# EAGLE board Slutsteg (EAGLE 9.6.2)
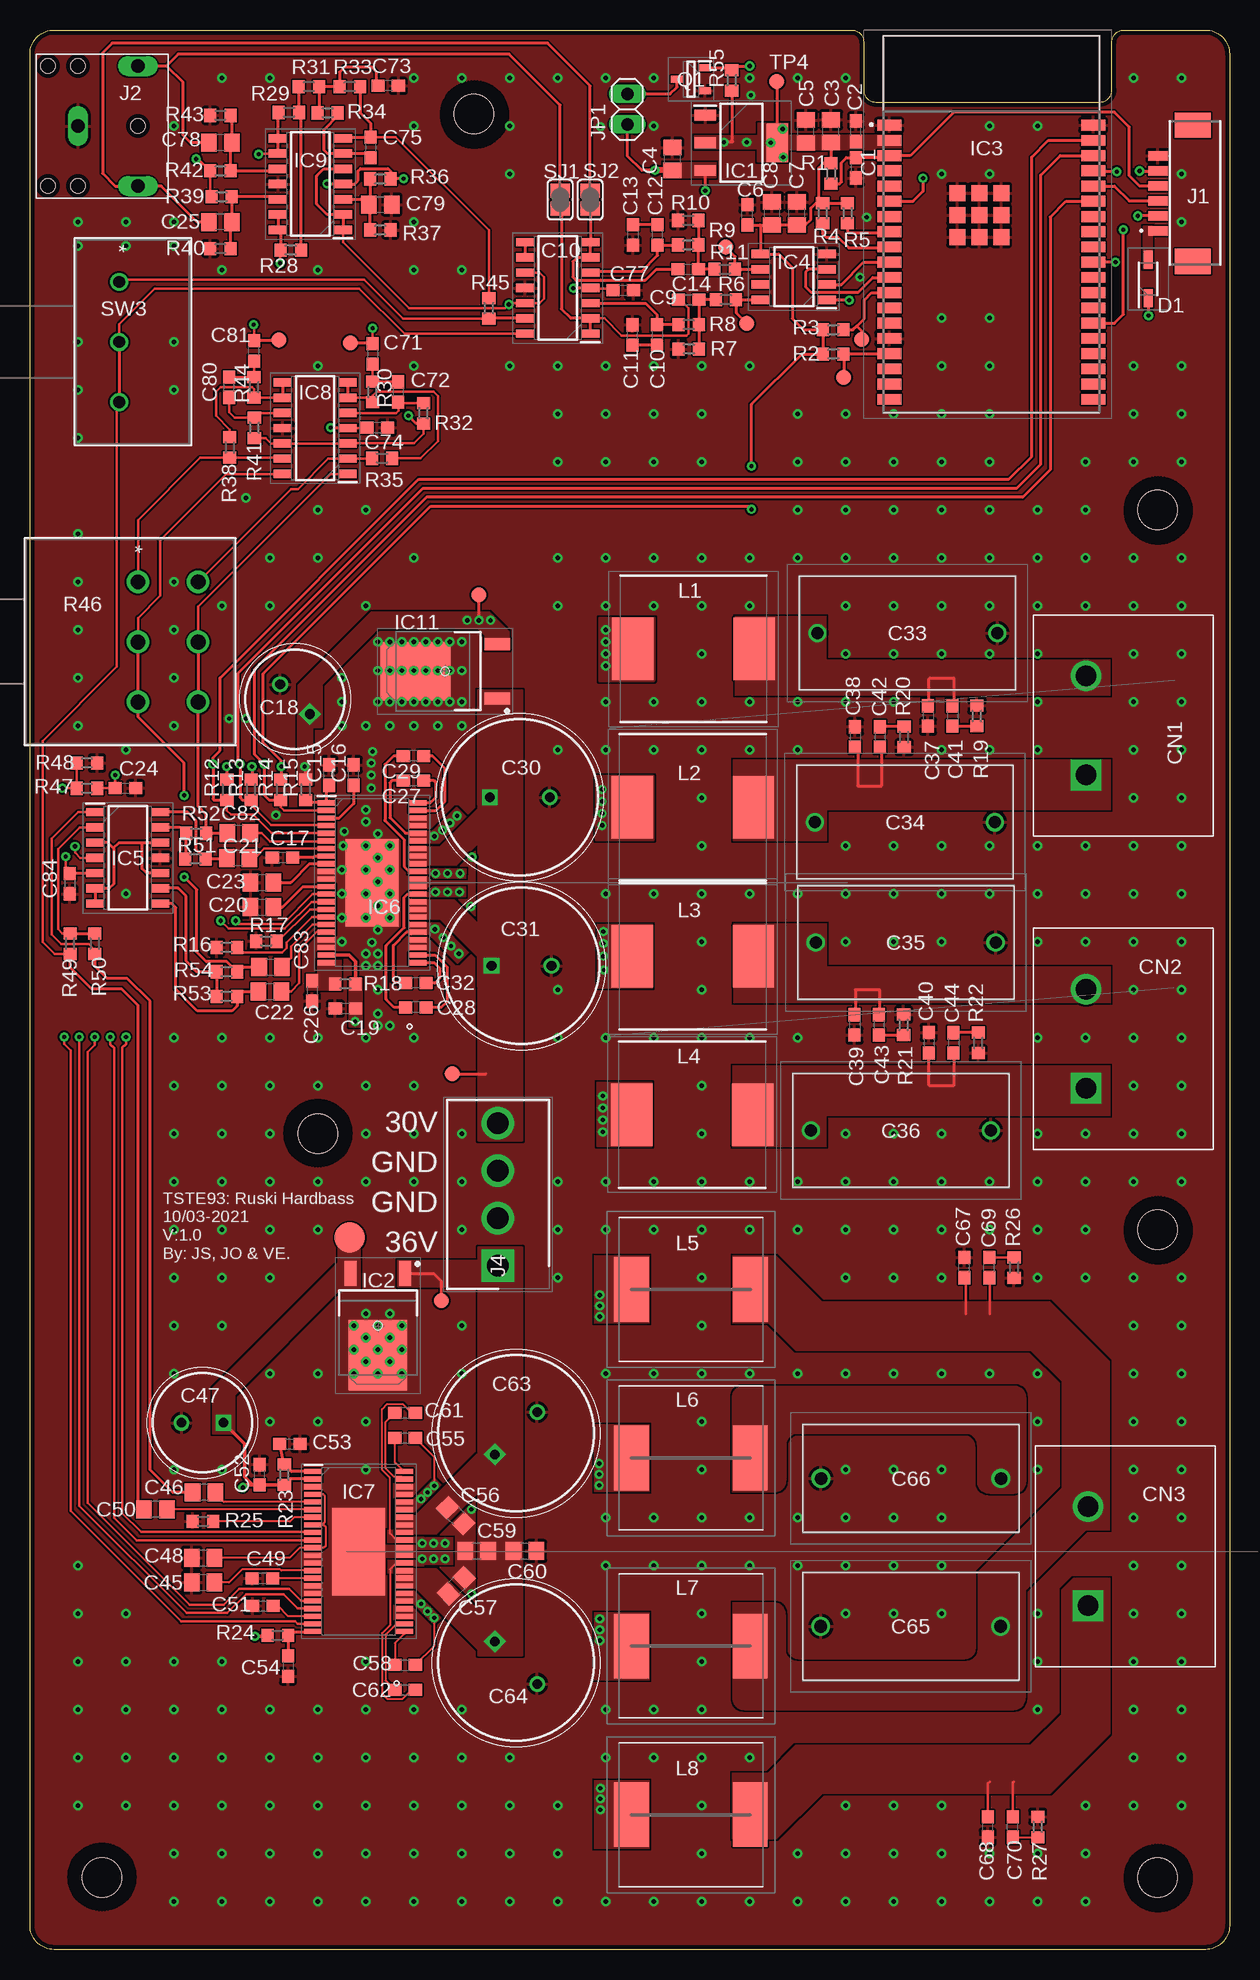
[diagram p6: board, top side]
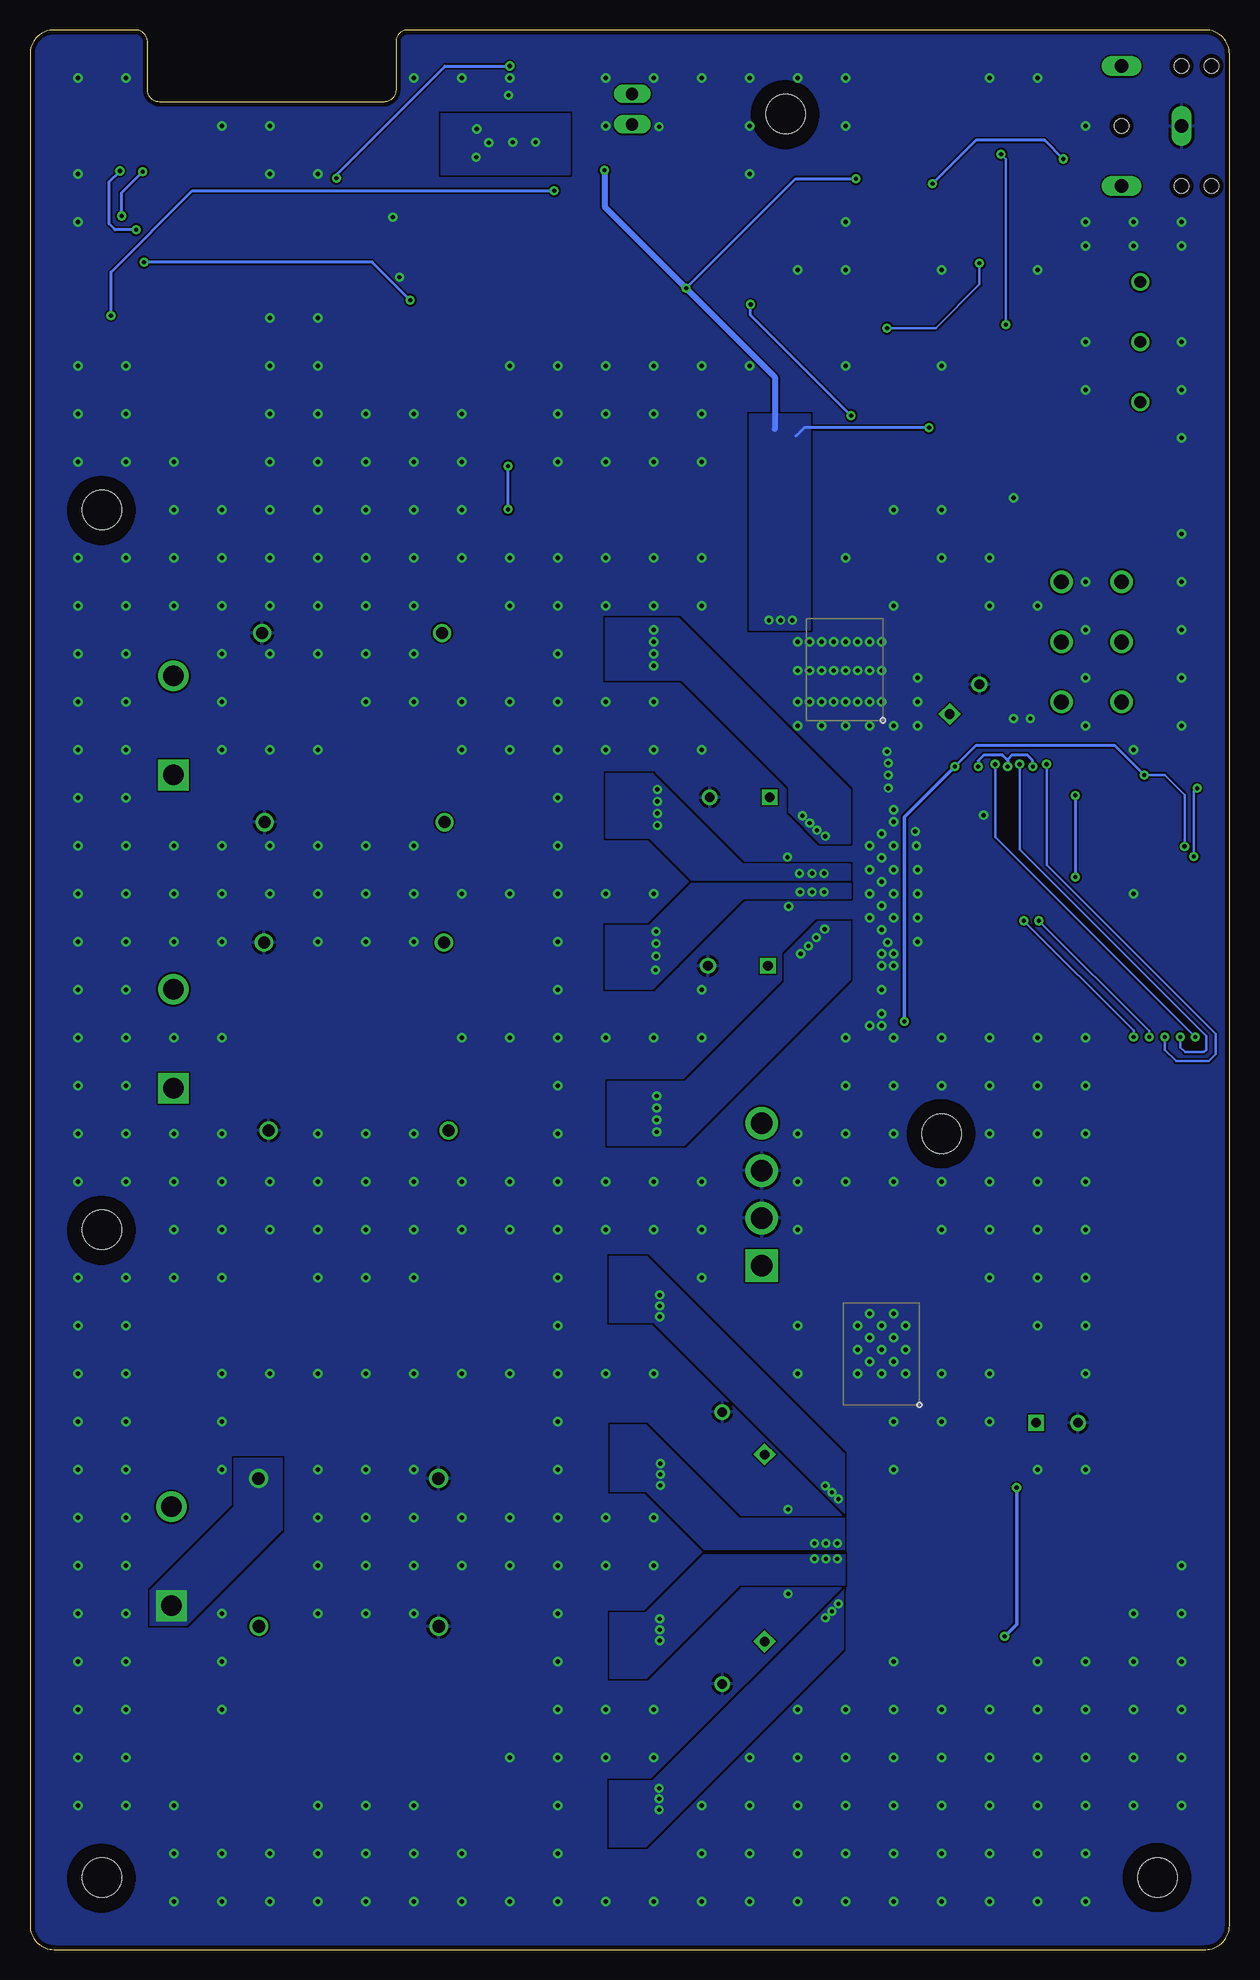
[diagram p7: board, bottom side, seen from below]

Size 100 x 160 mm. Coordinates in mm from the lower left corner, seen from the top.
Outline: 100,158 100,2 arc-90 98,0 2,0 arc-90 0,2 0,158 arc-90 2,160 68.5,160 arc-90 69.5,159 69.5,155 arc90 70.5,154 89.2,154 arc90 90.2,155 90.2,159 arc-90 91.2,160 98,160 arc-90 100,158
Copper layers (1*16): Top 0.035mm / dielectric 1.5mm / Bottom 0.035mm
Design rules "default *": minimum track width 6mil, minimum drill 0.35mm, track to track 6mil, track to pad 6mil, pad to pad 6mil, via to via 6mil, smd to smd 6mil, copper to edge 15mil, drill to drill 6mil, minimum pad ring 10mil, minimum via ring 8mil, stop-mask expansion 4mil, vias tented up to drill 20mil, thermal gap 10mil
Holes 3.3 mm at 6,6 94,6 94,60 94,120 37,153 24,68

## Footprints (pad centres in the part's own frame; a part is rotated, then mirrored left to right if it is on the bottom)
C0603 = smd 1.1 x 1: 1 -0.85,0; 2 0.85,0
C0805 = smd 1.3 x 1.5: 1 -0.95,0; 2 0.95,0
CAPPRD350W60D825H1300 = drill 0.8 pad 1.2 square: 1 0,0 | drill 0.8 pad 1.2: 2 3.5,0
CAPPRD500W60D1300H2650 = drill 0.8 pad 1.2 square: 1 0,0 | drill 0.8 pad 1.2: 2 5,0
PHE426HB7100JR06 = drill 1 pad 1.5: 1 0,0; 2 15,0
B32652A3684J = drill 1.05 pad 1.575: 1 0,0; 2 15,0
OSTYK33108030-2 = drill 1.7 square: 1 0,0 | drill 1.7: 2 8.25,0
SOD3816X145N = smd 1.5 x 0.75: 1 -1.6,0; 2 1.6,0
SOT230P700X180-4N = smd 1.8 x 0.9: 1 -3,2.3; 2 -3,0; 3 -3,-2.3 | smd 1.8 x 3.2: 4 3,0
TO228P972X240-3N = smd 2.1 x 1: 1 -4.35,2.28; 3 -4.35,-2.28 | smd 5.85 x 4.9: 4 2.45,0
ESP32WROVERE8MB = smd 2 x 0.9: 1 -8.5,8.26; 2 -8.5,6.99; 3 -8.5,5.72; 4 -8.5,4.45; 5 -8.5,3.18; 6 -8.5,1.91; 7 -8.5,0.64; 8 -8.5,-0.63; 9 -8.5,-1.9; 10 -8.5,-3.17; 11 -8.5,-4.44; 12 -8.5,-5.71; 13 -8.5,-6.98; 14 -8.5,-8.25; 15 -8.5,-9.52; 16 -8.5,-10.79; 17 -8.5,-12.06; 18 -8.5,-13.33; 19 -8.5,-14.6; 20 8.5,-14.6; 21 8.5,-13.33; 22 8.5,-12.06; 23 8.5,-10.79; 24 8.5,-9.52; 25 8.5,-8.25; 26 8.5,-6.98; 27 8.5,-5.71; 28 8.5,-4.44; 29 8.5,-3.17; 30 8.5,-1.9; 31 8.5,-0.63; 32 8.5,0.64; 33 8.5,1.91; 34 8.5,3.18; 35 8.5,4.45; 36 8.5,5.72; 37 8.5,6.99; 38 8.5,8.26 | smd 1.33 x 1.33: 39 -1,0.76; A39 -2.835,2.595; B39 -1,2.595; C39 0.835,2.595; D39 -2.835,0.76; E39 0.835,0.76; F39 -2.835,-1.075; G39 -1,-1.075; H39 0.835,-1.075
SOIC127P600X196-8N = smd 1.55 x 0.7: 1 -2.75,1.905; 2 -2.75,0.635; 3 -2.75,-0.635; 4 -2.75,-1.905; 5 2.75,-1.905; 6 2.75,-0.635; 7 2.75,0.635; 8 2.75,1.905
SOIC127P600X175-14N = smd 1.525 x 0.7: 1 -2.712,3.81; 2 -2.712,2.54; 3 -2.712,1.27; 4 -2.712,0; 5 -2.712,-1.27; 6 -2.712,-2.54; 7 -2.712,-3.81; 8 2.712,-3.81; 9 2.712,-2.54; 10 2.712,-1.27; 11 2.712,0; 12 2.712,1.27; 13 2.712,2.54; 14 2.712,3.81
SOP64P810X120-45N = smd 1.475 x 0.435: 1 -3.788,6.668; 2 -3.788,6.032; 3 -3.788,5.398; 4 -3.788,4.762; 5 -3.788,4.128; 6 -3.788,3.492; 7 -3.788,2.858; 8 -3.788,2.222; 9 -3.788,1.588; 10 -3.788,0.952; 11 -3.788,0.318; 12 -3.788,-0.318; 13 -3.788,-0.952; 14 -3.788,-1.588; 15 -3.788,-2.222; 16 -3.788,-2.858; 17 -3.788,-3.492; 18 -3.788,-4.128; 19 -3.788,-4.762; 20 -3.788,-5.398; 21 -3.788,-6.032; 22 -3.788,-6.668; 23 3.788,-6.668; 24 3.788,-6.032; 25 3.788,-5.398; 26 3.788,-4.762; 27 3.788,-4.128; 28 3.788,-3.492; 29 3.788,-2.858; 30 3.788,-2.222; 31 3.788,-1.588; 32 3.788,-0.952; 33 3.788,-0.318; 34 3.788,0.318; 35 3.788,0.952; 36 3.788,1.588; 37 3.788,2.222; 38 3.788,2.858; 39 3.788,3.492; 40 3.788,4.128; 41 3.788,4.762; 42 3.788,5.398; 43 3.788,6.032; 44 3.788,6.668 | smd 4.43 x 7.3: 45 0,0
SOP64P810X120-45N@1 = smd 1.475 x 0.435: 1 -3.788,6.668; 2 -3.788,6.032; 3 -3.788,5.398; 4 -3.788,4.762; 5 -3.788,4.128; 6 -3.788,3.492; 7 -3.788,2.858; 8 -3.788,2.222; 9 -3.788,1.588; 10 -3.788,0.952; 11 -3.788,0.318; 12 -3.788,-0.318; 13 -3.788,-0.952; 14 -3.788,-1.588; 15 -3.788,-2.222; 16 -3.788,-2.858; 17 -3.788,-3.492; 18 -3.788,-4.128; 19 -3.788,-4.762; 20 -3.788,-5.398; 21 -3.788,-6.032; 22 -3.788,-6.668; 23 3.788,-6.668; 24 3.788,-6.032; 25 3.788,-5.398; 26 3.788,-4.762; 27 3.788,-4.128; 28 3.788,-3.492; 29 3.788,-2.858; 30 3.788,-2.222; 31 3.788,-1.588; 32 3.788,-0.952; 33 3.788,-0.318; 34 3.788,0.318; 35 3.788,0.952; 36 3.788,1.588; 37 3.788,2.222; 38 3.788,2.858; 39 3.788,3.492; 40 3.788,4.128; 41 3.788,4.762; 42 3.788,5.398; 43 3.788,6.032; 44 3.788,6.668 | smd 4.43 x 7.3: 45 0,0
0532610671 = smd 0.8 x 1.6: 1 -3.125,1.004; 2 -1.875,1.004; 3 -0.625,1.004; 4 0.625,1.004; 5 1.875,1.004; 6 3.125,1.004 | smd 2.1 x 3: 7 -5.675,-1.896; 8 5.675,-1.896
JW-PJ-307-4H = drill 1.1 long: 1 -2,0; 2 3,5; 5 3,-5 | hole 1.2: -4.5,5; -2,5; 3,0; -4.5,-5; -2,-5
SHDR4W114P0X396_1X4_1578X850X9 = drill 1.8 pad 2.7 square: 1 0,0 | drill 1.8 pad 2.7: 2 3.96,0; 3 7.92,0; 4 11.88,0
1X02 = drill 1.016 long: 1 -1.27,0; 2 1.27,0
INDPM122122X600N = smd 3.45 x 5.2: 1 -5.05,0; 2 5.05,0
WE-PD_1260/1245/1280/121054 = smd 2.9 x 5.4: 1 -4.95,0; 2 4.95,0
BSS64AHZGT116 = smd 1 x 0.6: 1 -1.15,-0.95; 2 -1.15,0.95; 3 1.15,0
R0603 = smd 1 x 1.1: 1 -0.85,0; 2 0.85,0
PDB18-2 = drill 1.245 pad 1.753: 1 0,0; 2 5.004,0; 3 10.008,0; 4 0,5.004; 5 5.004,5.004; 6 10.008,5.004
SJ = smd 1.168 x 1.6: 1 -0.762,0; 2 0.762,0
SW_420F-103A2_BRN = drill 0.991 pad 1.499: 1 0,0; 2 5.004,0; 3 10.008,0
B2,54 = smd 2.54 x 2.54: TP 0,0
B1,27 = smd 1.27 x 1.27: TP 0,0

## Placement (x,y rotation side)
C1  100nF/50V  [C0603]  68.87,148.51 270 top
C2  100nF/50V  [C0603]  68.86,151.56 90 top
C3  10uF/16V  [C0805]  66.78,151.56 90 top
C4  10uF/16V  [C0805]  53.55,149.25 90 top
C5  10uF/16V  [C0805]  64.7,151.55 90 top
C6  100nF/50V  [C0603]  59.8,144.6 90 top
C7  10uF/16V  [C0805]  63.93,144.71 90 top
C8  10uF/16V  [C0805]  61.87,144.71 90 top
C9  1nF/50V  [C0603]  54.92,137.52 0 top
C10  1nF/50V  [C0603]  52.29,134.58 270 top
C11  1nF/50V  [C0603]  50.24,134.57 90 top
C12  1nF/50V  [C0603]  52.32,142.93 90 top
C13  1nF/50V  [C0603]  50.25,142.93 270 top
C14  1nF/50V  [C0603]  54.88,140.06 0 top
C15  100nF/50V  [C0603]  24.95,97.9 90 top
C16  100nF/50V  [C0603]  26.98,97.9 90 top
C17  10nF/50V  [C0603]  21.05,91.01 180 top
C18  16PK470MEFC8X11.5  [CAPPRD350W60D825H1300]  23.33,102.98 135 top
C19  100nF/50V  [C0603]  26.3,78.42 180 top
C20  1uF/50V  [C0805]  19.34,86.9 0 top
C21  10uF/16V  [C0805]  17.35,91 0 top
C22  10uF/16V  [C0805]  20,79.85 0 top
C23  1uF/50V  [C0805]  19.34,88.95 0 top
C24  100nF/50V  [C0603]  7.95,96.8 0 top
C25  1uF/50V  [C0805]  15.88,144 180 top
C26  100nF/50V  [C0603]  23.51,79.9 270 top
C27  33nF/50V  [C0603]  31.97,97.42 180 top
C28  33nF/50V  [C0603]  32.17,78.54 180 top
C29  33nF/50V  [C0603]  31.97,99.5 180 top
C30  ECA-1HM102B  [CAPPRD500W60D1300H2650]  38.33,96.04 0 top
C31  ECA-1HM102B  [CAPPRD500W60D1300H2650]  38.48,81.99 0 top
C32  33nF/50V  [C0603]  32.17,80.56 180 top
C33  PHE426HB7100JR06  [PHE426HB7100JR06]  80.65,109.74 180 top
C34  PHE426HB7100JR06  [PHE426HB7100JR06]  65.45,93.96 0 top
C35  PHE426HB7100JR06  [PHE426HB7100JR06]  80.5,83.94 180 top
C36  PHE426HB7100JR06  [PHE426HB7100JR06]  65.1,68.26 0 top
C37  1nF/50V  [C0603]  74.87,102.82 270 top
C38  1nF/50V  [C0603]  68.79,101.07 270 top
C39  1nF/50V  [C0603]  68.74,77.07 270 top
C40  1nF/50V  [C0603]  74.92,75.58 270 top
C41  10nF/50V  [C0603]  76.91,102.82 270 top
C42  10nF/50V  [C0603]  70.85,101.07 270 top
C43  10nF/50V  [C0603]  70.77,77.07 270 top
C44  10nF/50V  [C0603]  77,75.57 270 top
C45  1uF/50V  [C0805]  14.44,30.6 0 top
C46  10uF/16V  [C0805]  14.51,38.1 180 top
C47  ECA-1HM471B  [CAPPRD350W60D825H1300]  16.13,43.9 180 top
C48  1uF/50V  [C0805]  14.44,32.65 0 top
C49  10nF/50V  [C0603]  19.37,30.95 0 top
C50  10uF/16V  [C0805]  10.46,36.7 180 top
C51  100nF/50V  [C0603]  19.42,28.63 0 top
C52  100nF/50V  [C0603]  19.16,39.58 90 top
C53  100nF/50V  [C0603]  21.67,42.15 0 top
C54  100nF/50V  [C0603]  21.52,23.63 270 top
C55  33nF/50V  [C0603]  31.27,42.63 0 top
C56  1uF/50V  [C0805]  35.49,36.17 315 top
C57  1uF/50V  [C0805]  35.54,30.32 225 top
C58  33nF/50V  [C0603]  31.27,23.71 0 top
C59  1uF/50V  [C0805]  37.24,33.23 0 top
C60  1uF/50V  [C0805]  41.26,33.23 0 top
C61  33nF/50V  [C0603]  31.27,44.75 0 top
C62  33nF/50V  [C0603]  31.27,21.64 0 top
C63  ECA-1HM102B  [CAPPRD500W60D1300H2650]  38.76,41.26 45 top
C64  ECA-1HM102B  [CAPPRD500W60D1300H2650]  38.76,25.67 315 top
C65  B32652A3684J  [B32652A3684J]  65.92,26.94 0 top
C66  B32652A3684J  [B32652A3684J]  80.95,39.26 180 top
C67  1nF/50V  [C0603]  77.88,56.84 90 top
C68  1nF/50V  [C0603]  79.85,10.22 90 top
C69  10nF/50V  [C0603]  79.97,56.84 90 top
C70  10nF/50V  [C0603]  81.93,10.22 90 top
C71  100nF/50V  [C0603]  28.56,133 270 top
C72  100nF/50V  [C0603]  30.68,129.82 270 top
C73  150nF/50V  [C0603]  29.86,155.35 180 top
C74  100nF/50V  [C0603]  28.95,126.86 0 top
C75  33nF/50V  [C0603]  28.4,150.21 270 top
C77  100nF/50V  [C0603]  49.46,138.3 0 top
C78  1uF/50V  [C0805]  15.88,150.6 180 top
C79  1uF/50V  [C0805]  29.2,145.46 0 top
C80  100nF/50V  [C0603]  16.62,130.22 90 top
C81  100nF/50V  [C0603]  18.67,133.25 90 top
C82  10uF/16V  [C0805]  17.4,93.05 0 top
C83  10uF/16V  [C0805]  20.05,81.9 0 top
C84  100nF/50V  [C0603]  3.3,88.85 270 top
CN1  OSTYK33102030-2  [OSTYK33108030-2]  88.05,97.9 90 top
CN2  OSTYK33102030-2  [OSTYK33108030-2]  88.05,71.8 90 top
CN3  OSTYK33102030-2  [OSTYK33108030-2]  88.2,28.65 90 top
D1  STPS0520Z  [SOD3816X145N]  93.22,139.25 90 top
IC1  SPX1117M3-L-3-3_TR  [SOT230P700X180-4N]  59.3,150.6 0 top
IC2  L78M12ABDT-TR  [TO228P972X240-3N]  29,52 270 top
IC3  ESP32-WROVER-IE-4MB  [ESP32WROVERE8MB]  80.14,143.81 0 top
IC4  TM8211  [SOIC127P600X196-8N]  63.67,139.42 180 top
IC5  LM324D  [SOIC127P600X175-14N]  8.15,91 0 top
IC6  TPA3244DDWR  [SOP64P810X120-45N]  28.52,88.92 0 top
IC7  TPA3251D2DDVR  [SOP64P810X120-45N@1]  27.4,33.18 0 top
IC8  LM324D  [SOIC127P600X175-14N]  23.77,126.81 180 top
IC9  LM324D  [SOIC127P600X175-14N]  23.38,147.16 180 top
IC10  LM324D  [SOIC127P600X175-14N]  44,138.5 180 top
IC11  L78M12ABDT-TR  [TO228P972X240-3N]  34.6,106.55 180 top
J1  0532610671  [0532610671]  95.04,146.38 90 top
J2  JW-PJ-307-4H  [JW-PJ-307-4H]  6,152 0 top
J4  B4P-VH_LF__SN_  [SHDR4W114P0X396_1X4_1578X850X9]  39,57 90 top
JP1  [1X02]  49.8,153.4 90 top
L1  48100SC  [INDPM122122X600N]  55.31,108.41 0 top
L2  48100SC  [INDPM122122X600N]  55.26,95.21 0 top
L3  48100SC  [INDPM122122X600N]  55.26,82.78 0 top
L4  48100SC  [INDPM122122X600N]  55.21,69.6 0 top
L5  74477010  [WE-PD_1260/1245/1280/121054]  55.1,55.02 0 top
L6  74477010  [WE-PD_1260/1245/1280/121054]  55.09,40.97 0 top
L7  74477010  [WE-PD_1260/1245/1280/121054]  55.09,25.3 0 top
L8  74477010  [WE-PD_1260/1245/1280/121054]  55.09,11.25 0 top
Q1  RK7002BMT116  [BSS64AHZGT116]  55.1,155.9 180 top
R1  10K/5%/0.1W  [R0603]  66.78,148.03 270 top
R2  10K/5%/0.1W  [R0603]  66.97,132.99 0 top
R3  10K/5%/0.1W  [R0603]  66.97,135.01 0 top
R4  10K/5%/0.1W  [R0603]  66.08,144.73 270 top
R5  10K/5%/0.1W  [R0603]  68.15,144.73 270 top
R6  10K/5%/0.1W  [R0603]  58.02,137.53 0 top
R7  10K/5%/0.1W  [R0603]  54.93,133.4 180 top
R8  10K/5%/0.1W  [R0603]  54.92,135.45 0 top
R9  10K/5%/0.1W  [R0603]  54.88,142.08 180 top
R10  10K/5%/0.1W  [R0603]  54.88,144.13 180 top
R11  10K/5%/0.1W  [R0603]  57.93,140.06 180 top
R12  20K/5%/0.1W  [R0603]  16.41,96.67 90 top
R13  20K/5%/0.1W  [R0603]  18.43,96.67 90 top
R14  20K/5%/0.1W  [R0603]  20.9,96.67 90 top
R15  3.3R/5%/0.1W  [R0603]  22.98,96.67 90 top
R16  20K/5%/0.1W  [R0603]  16.4,83.53 0 top
R17  20K/5%/0.1W  [R0603]  19.7,84.05 0 top
R18  3.3R/5%/0.1W  [R0603]  26.3,80.49 0 top
R19  3.3R/5%/0.1W  [R0603]  78.93,102.82 270 top
R20  3.3R/5%/0.1W  [R0603]  72.87,101.07 270 top
R21  3.3R/5%/0.1W  [R0603]  72.83,77.07 270 top
R22  3.3R/5%/0.1W  [R0603]  79.05,75.57 270 top
R23  3.3R/5%/0.1W  [R0603]  21.2,39.58 90 top
R24  3.3R/5%/0.1W  [R0603]  20.65,26.18 0 top
R25  20K/5%/0.1W  [R0603]  14.43,35.68 0 top
R26  3.3R/5%/0.1W  [R0603]  82.04,56.84 90 top
R27  3.3R/5%/0.1W  [R0603]  84.01,10.22 90 top
R28  1K/5%/0.1W  [R0603]  21.74,141.65 180 top
R29  1K/5%/0.1W  [R0603]  21.59,153.13 180 top
R30  10K/5%/0.1W  [R0603]  28.56,129.82 90 top
R31  18K/5%/0.1W  [R0603]  23.25,155.28 180 top
R32  10K/5%/0.1W  [R0603]  32.81,128.05 270 top
R33  18K/5%/0.1W  [R0603]  26.66,155.28 180 top
R34  10K/5%/0.1W  [R0603]  24.81,153.09 180 top
R35  10K/5%/0.1W  [R0603]  29.35,124.3 0 top
R36  100K/5%/0.1W  [R0603]  29.2,147.58 0 top
R37  100K/5%/0.1W  [R0603]  29.2,143.33 180 top
R38  10K/5%/0.1W  [R0603]  16.65,125.2 270 top
R39  100K/5%/0.1W  [R0603]  15.97,146.1 180 top
R40  100K/5%/0.1W  [R0603]  15.88,141.78 0 top
R41  10K/5%/0.1W  [R0603]  18.71,126.85 270 top
R42  100K/5%/0.1W  [R0603]  15.88,148.26 180 top
R43  100K/5%/0.1W  [R0603]  15.88,152.88 0 top
R44  10K/5%/0.1W  [R0603]  18.67,130.22 90 top
R45  10K/5%/0.1W  [R0603]  38.25,136.8 270 top
R46  PDB182-K430K-503A  [PDB18-2]  9,114 270 top
R47  100K/5%/0.1W  [R0603]  4.75,96.8 0 top
R48  100K/5%/0.1W  [R0603]  4.75,98.9 180 top
R49  10K/5%/0.1W  [R0603]  3.35,83.85 270 top
R50  10K/5%/0.1W  [R0603]  5.4,83.85 90 top
R51  100K/5%/0.1W  [R0603]  13.8,90.9 0 top
R52  100K/5%/0.1W  [R0603]  13.85,93.05 180 top
R53  100K/5%/0.1W  [R0603]  16.4,79.45 0 top
R54  100K/5%/0.1W  [R0603]  16.4,81.5 180 top
R55  10K/5%/0.1W  [R0603]  58.5,155.8 90 top
SJ1  [SJ]  44.2,145.85 90 top
SJ2  [SJ]  46.7,145.85 90 top
SW3  PDB181-K420F-103A2  [SW_420F-103A2_BRN]  7.44,139 270 top
TP1  TPB2,54  [B2,54]  26.65,59.35 0 top
TP2  TPB1,27  [B1,27]  34.3,54.1 0 top
TP3  TPB1,27  [B1,27]  35.2,73 0 top
TP4  TPB1,27  [B1,27]  62.25,155.7 0 top
TP5  TPB1,27  [B1,27]  37.4,112.9 0 top
TP6  TPB1,27  [B1,27]  26.7,133.9 0 top
TP7  TPB1,27  [B1,27]  20.75,134.15 0 top
TP8  TPB1,27  [B1,27]  69.35,134.2 0 top
TP9  TPB1,27  [B1,27]  67.85,131.05 0 top
TP10  TPB1,27  [B1,27]  59.75,135.55 0 top
TP11  TPB1,27  [B1,27]  58,141.9 0 top
U$1  V5618C  [V5618C]  30.55,22.2 90 top
U$2  V5618C  [V5618C]  31.65,76.95 90 top
U$3  V5618A  [V5618A]  25.85,45.4 90 bottom
U$4  V5618A  [V5618A]  28.9,102.45 90 bottom

## Tracks (layer width: path | path; a pad name or v marks a point on that pad's centre or on a via)
6V_BUFFER  (via drill 0.35)
  Top 0.203: R41.2 19.65,126 20.11,125.54 IC8.12 IC8.3 26.49,125.55 32,125.55 32.81,126.36 R32.2 | IC10.10 42.48,139.77 42.85,139.4 42.85,137.6 42.48,137.23 IC10.12 41.27,137.25 40.05,137.25 v39.92,137.12 39.6,136.8 31.6,136.8 26.09,142.31 IC9.1
  Top 0.254: IC9.1 IC9.2 24.78,144.62 23.9,145.5 23.9,147.85 24.48,148.43 IC9.5 | R32.2 32.2,127.2 v31.55,127.85
  Bottom 0.254: v31.55,127.85 39.92,136.22 v39.92,137.12
6V_BUFFER2
  Top 0.254: 6.95,91.8 7,91.75 7,88.85 6.61,88.46 IC5.6 IC5.7 | 6.95,91.8 6.48,92.27 IC5.3 | 6.95,91.8 7.42,92.27 9.35,92.27 | 9.35,92.27 IC5.12 | IC5.10 9.72,89.73 9.35,90.1 9.35,92.27
+3V3  (via drill 0.35)
  Top 0.254: C8.1 62.1,143.76 | 62.1,143.76 C7.1 64.66,143.76 65.1,144.2 65.1,145.15 65.53,145.58 R4.1 | C6.1 60.85,143.75 | 60.85,143.75 62.09,143.75 62.1,143.76 | 60.85,143.75 60.92,143.68 IC4.5 62.42,141.32 63.55,140.2 63.55,135.95 64.49,135.01 R3.1 R2.1 | C3.1 66.78,148.9 | 66.78,148.9 R1.1 | R4.1 R5.1 | R2.1 | R4.1 65.75,145.91 65.75,148.5 66.15,148.9 66.78,148.9 | v16.4,98.6 16.4,97.53 R12.2 | v18.5,98.6 18.5,97.59 R13.2 | R14.2 20.95,97.58 v20.95,98.6 20.95,99.1 19.45,100.6 19.45,106.35 33.4,120.3 59.9,120.3 v60.15,120.05 | v60.15,123.65 60.15,128.8 64.35,133 R2.1 | TP4.TP 62.25,151.2 62.3,151.15 IC1.4 | R55.1 58.5,150.8 58.6,150.7 58.55,150.65 v57.85,150.65
  Bottom 0.254: v16.4,98.6 16.4,99.1 16.85,99.55 18.15,99.55 18.5,99.2 18.5,99.1 | 18.5,99.1 v18.5,98.6 | 18.5,99.1 18.95,99.55 20.5,99.55 20.95,99.1 v20.95,98.6 | v60.15,120.05 v60.15,123.65
  other vias: 62.8,149.4 62.75,151.75 61.75,150.6 59.75,150.65
  pour Top (no thermals): 63.2,152.2 60.7,152.2 60.7,151.15 55.4,151.15 55.4,150.15 60.65,150.15 60.65,149.05 63.2,149.05
  pour Top (no thermals): 72.6,151.2 63.1,151.2 63.1,150.05 72.6,150.05
  pour Bottom: 55,153 65.75,153 65.75,148 55,148
+5V
  pour Top (no thermals): 92.8,143.6 92.8,140.15 93.55,140.15 93.55,143.6
BASE_VOLUME
  Top 0.203: R45.1 38.25,143.3 30.49,151.06 C75.1
  Top 0.254: R33.1 27.51,153.1 28.4,152.21 C75.1 26.18,151.06 IC9.7
CLIP_OTW  (via drill 0.35)
  Top 0.203: IC6.2 21.2,94.95 20.9,95.25 R14.1 | IC7.21 22.3,27.15 22.1,27.35 12.6,27.35 3.4,36.55 3.4,74.95 2.85,75.5 v2.85,76.06
  Top 0.254: IC3.33 86.37,145.72 85.05,144.4 85.05,123.35 82.75,121.05 33.05,121.05 19.55,107.55 18.69,106.69 18.69,99.65 v19.54,98.8 19.54,96.21 19.93,95.83 R14.1
  Bottom 0.203: v2.85,76.06 19.54,92.75 v19.54,98.8
DAC-L_N
  Top 0.254: IC4.6 R11.1 58.78,141.12 TP11.TP
DAC-R_P
  Top 0.254: R6.2 58.9,137.53 | 58.9,137.53 60.91,137.53 IC4.8 | TP10.TP 58.9,136.4 58.9,137.53
EN
  Top 0.254: R1.2 67.48,147.18 67.65,147.35 67.65,148.95 68.06,149.36 C1.1 71.47,149.36 IC3.3 73.38,149.53 77,153.15 90.4,153.15 91.65,151.9 91.65,147.85 92.5,147 J1.4
FAULT  (via drill 0.35)
  Top 0.203: IC6.4 24.68,93.73 20.12,93.73 18.45,95.4 18.45,95.81 R13.1 | IC7.19 22.33,28.42 21.15,29.6 18,29.6 16.45,28.05 13.05,28.05 4.1,37 v4.1,76.06
  Top 0.254: IC3.36 85.88,149.53 84.25,147.9 84.25,123.8 82.25,121.8 32.75,121.8 17.3,106.35 17.3,99 v17.5,98.8 17.5,96.05 17.73,95.83 R13.1
  Bottom 0.203: v4.1,76.06 4.1,75.2 3.7,74.8 2.15,74.8 1.95,75 1.95,76.15 17.5,91.7 v17.5,98.8
GND  (via drill 0.35)
  other vias: 69.2,139.4 36.85,91.05 36.75,86.95 36.8,29.65 36.8,36.7 69.75,144.4 20.5,94.55 16,156 20,156 36,156 32,156 40,156 48,156 44,156 52,156 60,156 64,156 68,156 92,156 96,156 12,152 32,152 40,152 47.55,151.95 52,152 60.1,154.55 96,148 96,144 80,148 80,152 84,152 76,148 36,140 32,140 24,140 32,144 16,140 12,142 8,142 4,142 4,144 8,144 12,144 40,148 76,136 80,136 76,132 80,132 80,128 76,128 92,128 92,132 96,132 96,128 64,128 68,128 72,128 60,132 56,132 52,132 48,132 44,132 40,132 32,132 24,132 12,134 12,130 4,134 4,130 4,126 4,118 44,128 48,128 52,128 56,128 56,124 52,124 48,124 44,124 64,124 68,124 72,124 76,124 80,124 88,124 92,124 96,124 88,120 84,120 80,120 76,120 72,120 68,120 64,120 96,116 92,116 88,116 84,116 80,116 76,116 72,116 68,116 64,116 60,116 56,116 52,116 48,116 44,116 32,116 28,112 24,120 28,120 20,116 16,112 20,112 4,114 4,110 4,106 4,102 24,116 18,121 12,102 12,106 12,110 12,114 48,104 52,104 56,104 56,108 56,112 52,112 48,112 44,112 60,112 68,112 72,112 76,112 80,112 84,112 88,112 92,112 96,112 96,108 96,104 96,100 96,96 92,100 92,104 92,108 68,108 72,108 76,108 80,108 84,108 92,96 96,92 92,92 88,92 84,92 80,92 76,92 72,92 68,92 56,92 56,96 56,100 60,100 64,100 60,104 64,104 68,104 72,104 84,100 84,104 80,100 76,100 52,100 48,100 44,100 8,100 8,88 12,76 16,76 20,76 24,76 28,76 32,76 48,76 52,76 56,76 60,76 64,76 84,76 88,76 92,76 96,76 96,80 92,80 92,84 96,84 96,88 92,88 88,88 84,88 88,84 84,84 80,88 76,88 76,84 72,84 72,88 68,88 68,84 64,88 60,88 56,88 52,88 48,88 56,84 56,80 56,72 56,68 56,64 60,64 64,64 68,64 68,68 72,68 72,64 76,64 76,68 80,64 84,64 84,68 88,68 92,68 92,72 96,72 96,68 96,64 92,64 88,64 88,60 84,60 80,60 76,60 72,60 68,60 64,60 60,60 56,60 52,60 48,60 44,60 44,64 48,64 52,64 68,56 72,56 76,56 84,56 88,56 92,56 96,56 32,72 28,72 24,72 20,72 16,72 12,72 12,68 12,64 12,60 12,56 12,52 12,48 12,40 16,40 20,44 24,44 24,48 20,48 36,52 36,48 16,52 16,56 16,60 16,64 16,68 20,68 20,64 20,60 20,56 24,60 24,64 28,68 28,64 32,64 32,68 36,68 36,64 36,60 44,56 28,40 28,44 56,56 56,52 56,48 52,48 48,48 56,44 56,40 56,36 52,36 48,32 48,36 52,32 56,32 56,28 60,32 64,32 68,32 60,36 64,36 68,36 72,36 72,32 76,32 76,36 76,40 72,40 68,40 76,28 72,28 68,28 92,52 96,52 96,48 92,48 92,44 96,44 96,40 92,40 92,36 96,36 96,32 92,32 92,28 96,28 96,24 92,24 84,40 84,44 84,48 80,48 76,48 72,48 68,48 64,48 60,48 96,20 96,16 96,12 92,12 92,16 92,20 88,12 88,8 88,4 84,4 80,4 76,4 76,8 76,12 72,12 68,12 68,8 64,8 64,4 72,8 72,4 68,4 60,4 56,4 56,8 52,4 56,12 56,16 60,16 52,16 48,16 48,20 52,20 56,20 56,24 84,20 84,24 84,28 84,8 80,8 48,4 40,4 44,4 44,8 44,12 40,12 40,16 36,16 36,20 32,20 40,8 36,8 36,4 32,4 28,4 24,4 20,4 16,4 12,4 12,8 16,8 20,8 24,8 28,8 32,8 32,12 36,12 32,16 28,16 28,12 24,12 20,12 16,12 12,12 8,12 4,12 4,16 8,16 12,16 16,16 20,16 24,16 28,20 24,20 20,20 16,20 12,20 8,20 4,20 4,24 8,24 12,24 16,24 8,28 4,28 4,32 28,24 44,76 44,80 31,104 32,104 33,104 34,104 35,104 35,106.6 34,106.6 34,109 33,109 33,106.6 35,109 32,109 32,106.6 31,106.6 30,106.6 30,104 30,109 31,109 29,109 29,106.6 29,104 36,106.6 36,109 36,104 26,102 28,102 30,102 32,102 34,102 36,102 26,104 26,106 28,95 30,92 28,92 26.1,92 28,90 30,90 26,90 26,88 28,88 30,88 30,86 28,86 26,86 28.5,83.95 26,84 28,83 28,82 29,82 29,83 29,80 29,78 30,77 29,77 29,91 29,89 29,87 29,85 29,93 28.45,96.8 28.45,97.9 28.45,98.9 28.55,99.85 28,94 26.2,93.2 27,48 28,49 29,50 30,51 31,52 30,53 29,52 28,51 27,50 27,52 28,53 31,50 30,49 29,48 31,48 16.6,102.6 18,102.6
  pour Bottom (rank 3): -1,161 101,161 101,-1 -1,-1
  pour Top (rank 3, no thermals): 37.05,89.4 29.6,89.4 29.6,88.4 37.05,88.4
  pour Top (no thermals): 27.5,90.05 24.05,90.05 24.05,89.05 27.5,89.05
  pour Top (rank 4): -1,161 101,161 101,-1 -1,-1
  pour Top (rank 2, no thermals): 25.95,53.15 32.15,53.15 32.15,46.15 25.95,46.15
  pour Bottom (no thermals): 32,62.9 36.2,62.9 36.2,59 32,59
  pour Top (rank 2, no thermals): 37.15,67 41,67 41,59 37.15,59
  pour Top (rank 2, no thermals): 38,28 38,38.45 37.95,38.5 33.6,38.5 33.5,38.4 33.5,28.05 33.55,28
  pour Top (rank 2, no thermals): 28.5,109.8 36,109.8 36,103.45 28.5,103.45
  pour Top (rank 3, no thermals): 23.3,96.7 33.35,96.7 33.35,81.7 23.3,81.7
  pour Top (rank 3, no thermals): 22.3,40.7 32.35,40.7 32.35,25.7 22.3,25.7
GSDJT
  Top 0.203: IC10.2 47.89,135.96 49.32,134.53 54.73,134.53 54.9,134.7 54.9,136.8 54.18,137.52 C9.1
  Top 0.254: IC10.1 IC10.2 45.09,135.96 44.3,136.75 44.3,144.99 SJ1.1
I/O-0  (via drill 0.35)
  Top 0.254: IC3.25 90.41,135.56 91.15,136.3 v91.15,143.35 | v92.5,148.25 J1.5
  Bottom 0.254: v91.15,143.35 92.9,143.35 93.4,143.85 93.4,147.35 v92.5,148.25
INPUT_A
  Top 0.254: C22.1 17.65,79.85 R53.2 17.25,78.65 16.85,78.25 13.95,78.25 12.15,80.05 12.15,86.85 11.81,87.19 IC5.8
INPUT_A_SLAVE
  Top 0.203: R50.1 5.4,83.3 4.9,83.8 2.6,83.8 1.8,84.6 1.8,92.6 4.01,94.81 IC5.1
  Top 0.254: C46.2 11.9,38.1 10,40 10,79.05 8.1,80.95 6.45,80.95 5.4,82 R50.1
INPUT_B  (via drill 0.35)
  Top 0.203: R46.2 9,111 10.85,112.85 10.85,117.5 16.35,123 IC8.14
  Top 0.254: R46.2 R46.3 9,102.75 12.85,98.9 v12.85,96.2 | C83.1 17.65,81.9 R54.1 16.4,82.35 14.7,82.35 13.9,83.15 13.9,88.35 v12.85,89.4
  Bottom 0.254: v12.85,96.2 v12.85,89.4
INPUT_B_SLAVE
  Top 0.203: R49.2 2.05,83 1.05,84 1.05,100.75 7.24,106.94 7.24,128.79 SW3.3 | SW3.2 7.44,135.49 10.4,138.45 27.45,138.45 31.21,134.69 IC10.14
  Top 0.254: C50.2 9,37.21 9,78.7 7.62,80.08 5.12,80.08 3.35,81.85 R49.2 | SW3.2 SW3.3
INPUT_C
  Top 0.254: C21.1 16.3,90.9 R51.2 13.85,91.7 13.85,94.1 13.14,94.81 IC5.14
INPUT_D
  Top 0.203: R46.5 14,111.95 25.05,123 IC8.1
  Top 0.254: C82.1 R52.1 14.7,94.6 14,95.3 R46.6 R46.5
ISOLATION
  cutout Bottom: 8.85,6 arc-90 6.05,3.2 arc-90 3.25,6 arc-90 6.05,8.8 arc-90
  cutout Top: 96.85,5.95 arc-90 94.05,3.15 arc-90 91.25,5.95 arc-90 94.05,8.75 arc-90
  cutout Top: 96.85,59.95 arc-90 94.05,57.15 arc-90 91.25,59.95 arc-90 94.05,62.75 arc-90
ISOLATION1
  cutout Bottom: 26.85,68 arc-90 24.05,65.2 arc-90 21.25,68 arc-90 24.05,70.8 arc-90
ISOLATION2
  cutout Top: 96.85,119.95 arc-90 94.05,117.15 arc-90 91.25,119.95 arc-90 94.05,122.75 arc-90
ISOLATION3
  cutout Top: 39.85,152.95 arc-90 37.05,150.15 arc-90 34.25,152.95 arc-90 37.05,155.75 arc-90
ISOLATION4
  cutout Top: 6,8.85 arc-90 8.8,6.05 arc-90 6,3.25 arc-90 3.2,6.05 arc-90
ISOLATION5
  cutout Bottom: 96.85,5.95 arc-90 94.05,3.15 arc-90 91.25,5.95 arc-90 94.05,8.75 arc-90
ISOLATION6
  cutout Bottom: 96.85,59.95 arc-90 94.05,57.15 arc-90 91.25,59.95 arc-90 94.05,62.75 arc-90
ISOLATION7
  cutout Top: 24,70.85 arc-90 26.8,68.05 arc-90 24,65.25 arc-90 21.2,68.05 arc-90
ISOLATION8
  cutout Bottom: 96.85,119.95 arc-90 94.05,117.15 arc-90 91.25,119.95 arc-90 94.05,122.75 arc-90
ISOLATION9
  cutout Bottom: 39.85,152.95 arc-90 37.05,150.15 arc-90 34.25,152.95 arc-90 37.05,155.75 arc-90
LEFT  (via drill 0.35)
  Top 0.203: C71.1 v28.56,135.14 v28.55,135.15 | v20.85,140.55 20.85,141.61 R28.2
  Top 0.254: IC9.13 IC9.14 20.89,143.13 R28.2 | C71.1 28.51,133.9 TP6.TP
  Bottom 0.203: v28.55,135.15 24.5,135.15 20.85,138.8 v20.85,140.55
LEFT_VOLUME
  Top 0.203: IC8.6 28.18,129.35 R30.1 28.56,129.53 28.88,129.85 33.65,129.85 34,129.5 34,125.75 32.55,124.3 R35.2
  Top 0.254: IC8.7 IC8.6
N$1
  Top 0.254: C20.2 21.05,86.9 22.75,88.6 IC6.12
N$2
  Top 0.152: C70.1 R27.1
N$3
  Top 0.152: IC7.44 30.42,40.62 C55.1
N$4
  Top 0.203: R45.2 31.1,135.95 27.85,139.2 7.64,139.2 SW3.1
  Top 0.254: IC10.13 38.61,135.96 R45.2
N$5
  Top 0.254: IC10.8 IC10.9
N$6  (via drill 0.35)
  Top 0.203: R48.2 R47.1 v2.7,96.8 | v2.98,91.1 2.98,90.02 3.25,89.75
  Top 0.254: 3.25,89.75 C84.1 3.33,89.73 IC5.5
  Bottom 0.203: v2.7,96.8 2.98,96.52 v2.98,91.1
N$7
  Top 0.203: IC6.6 24.67,92.35 20,92.35 19.3,93.05 C82.2
N$8
  Top 0.254: R51.1 13,90.95 R52.2 12.51,93.54 IC5.13
N$9
  Top 0.203: R49.1 2.7,84.7 2.35,85.05 2.35,91.75 4.14,93.54 IC5.2
  Top 0.254: R49.1 R50.2
N$10
  Top 0.203: C83.2 21.75,82.65 21.75,83.6 23.58,85.43 IC6.17
N$12
  Top 0.254: R53.1 R54.2 13.9,81.5 13,82.4 13,87.8 12.34,88.46 IC5.9
N$13  (via drill 0.35)
  Top 0.254: Q1.1 58.3,156.85 R55.2 58.85,157 v60,157 | v74.45,147.65 74.45,146.55 73.62,145.72 IC3.6
  Bottom 0.254: v74.45,147.65 74.45,147.95 65.4,157 v60,157
N$14
  Top 0.254: JP1.2 53.37,154.67 53.95,155.25 Q1.3
N$18  (via drill 0.35)
  Top 0.152: C55.2 33.7,41.05 v33.7,38.65
  other vias: 32.6,37.55 33.15,38.1 47.5,52.75 47.5,53.65 47.5,54.55
  pour Top (no thermals): 30.5,37.5 31.95,37.5 33.73,39.27 34.27,38.73 32.05,36.5 30.5,36.5
  pour Bottom (no thermals): 32.1,41.3 32.1,36.35 48,52.25 51.7,52.25 51.7,57.8 48.6,57.8
  pour Top (no thermals): 51.65,57.8 47,57.8 47,52.5 47,52.25 51.65,52.25
N$19  (via drill 0.35)
  Top 0.152: IC7.35 31.18,34.12 30.56,34.12 30,34.68 30,39.33 29.34,39.99 29.34,45.04 29.77,45.48 31.07,45.48 31.79,44.75 C61.2
  other vias: 32.7,33.85 33.65,33.85 34.6,33.85 47.45,38.7 47.45,39.6 47.45,40.5
  pour Top (rank 2, no thermals): 30.35,34.4 32.8,34.4 32.8,33.9 29,33.9 29,35 30.35,35
  pour Top: 32.25,34.3 32.25,33.35 35.25,33.35 35.25,34.3
  pour Bottom (no thermals): 32.05,33.35 32.05,35.95 40.85,35.95 48.65,43.75 51.65,43.75 51.65,38.2 48.65,38.2 43.8,33.35
  pour Top (no thermals): 51.65,43.75 47,43.75 47,38.45 47,38.2 51.65,38.2
N$20
  Top 0.152: IC7.23 31.19,26.31 30.42,25.54 C58.1
N$25
  Top 0.152: IC7.24 31.18,27.16 30.56,27.16 29.64,26.24 29.64,22.42 C62.1
N$26  (via drill 0.35)
  Top 0.152: IC7.32 31.18,32.24 30.56,32.24 30,31.68 30,27.03 29.34,26.37 29.34,21.35 29.77,20.91 31.07,20.91 31.79,21.64 C62.2
  other vias: 32.7,32.55 33.65,32.55 34.6,32.55 47.5,25.75 47.5,26.65 47.5,27.55
  pour Top (rank 2, no thermals): 30.35,32 32.85,32 32.85,32.45 29.8,32.45 29.8,31.4 30.35,31.4
  pour Top (no thermals): 32.25,33.05 32.25,32.1 35.25,32.1 35.25,33.05
  pour Bottom (no thermals): 32.05,32.95 32.05,30.35 40.85,30.35 48.65,22.55 51.65,22.55 51.65,28.1 48.65,28.1 43.8,32.95
  pour Top (no thermals): 51.65,28.05 47,28.05 47,22.75 47,22.5 51.65,22.5
N$27
  Top 0.152: IC7.5 23.6,37.3 16.16,37.3 15.46,38 C46.1
N$28
  Top 0.152: IC7.6 11.44,36.67 C50.1
N$29
  Top 0.254: IC7.1 21.78,39.85 R23.2 C53.1
N$30
  Top 0.152: IC7.20 21.52,27.78 20.67,28.63 C51.2
N$31
  Top 0.152: IC7.15 C49.2
N$32
  Top 0.152: IC7.14 20.95,31.59 20.86,31.68 17.68,31.68 16.6,30.6 C45.2
N$33
  Top 0.152: IC7.4 23.62,37.95 24.44,37.95 24.58,37.82 24.58,35.63 24.39,35.44 23.65,35.44 IC7.8 23.62,35.41 24.49,35.41 24.63,35.28 24.63,33.62 24.49,33.49 23.62,33.49 IC7.11 22.5,33.5 21.65,32.65 C48.2
N$34
  Top 0.152: IC7.7 22.04,36.04 21.68,35.68 R25.2
N$35
  Top 0.152: IC7.43 31,39.4 30.36,39.4 29.64,40.12 29.64,43.97 C61.1
N$36  (via drill 0.35)
  Top 0.152: v33.7,27.65 33.7,25.29 C58.2
  other vias: 32.6,28.8 33.15,28.2 47.55,13.45 47.55,12.55 47.55,11.65
  pour Top (no thermals): 30.5,28.85 31.95,28.85 33.7,27.1 34.25,27.65 32.05,29.85 30.5,29.85
  pour Bottom (no thermals): 32.15,25.05 32.15,30 48.1,14.05 51.75,14.05 51.75,8.55 48.65,8.55
  pour Top (no thermals): 51.65,14.05 47,14.05 47,8.45 51.65,8.45
N$37
  Top 0.152: IC7.22 23.56,26.51 23.51,26.46
  Top 0.254: 23.51,26.46 21.78,26.46 R24.2 21.52,26.16 C54.1
N$38
  Top 0.2: R26.2 C69.2
N$44
  Top 0.254: IC6.44 33.39,95.59 33.85,96.05 33.85,97.25 33.68,97.42 C27.1
N$45
  Top 0.254: IC6.43 33.85,94.95 34.6,95.7 34.6,98.45 33.55,99.5 C29.1
N$46
  Top 0.254: IC9.12 20.46,146.1 R39.1 C25.1 16.73,143.9 R40.2
N$47
  Top 0.254: R43.2 16.82,152.78 C78.1 16.73,150.5 R42.1 20.5,148.26 IC9.10
N$48
  Top 0.254: C41.2 R19.2
N$49
  Top 0.254: R20.1 C42.1
N$50
  Top 0.254: IC9.3 26.13,145.85 27.85,145.85 C79.1 28.35,145.56 | R36.1 28.35,145.56 | R37.2 28.35,145.56
N$51
  Top 0.254: IC6.24 33.76,82.89 34.75,81.9 34.75,79 34.29,78.54 C28.1
N$52
  Top 0.254: IC6.23 33.7,82.25 34.15,81.8 34.15,80.95 33.76,80.56 C32.1
N$53
  Top 0.254: C43.2 R21.2
N$54
  Top 0.254: R22.1 C44.1
N$55
  Top 0.203: R17.2 20.7,84.05 23.35,86.7 IC6.15
N$56
  Top 0.254: C16.1 26.98,95.52 25.78,94.32 IC6.3
N$57
  Top 0.254: C17.1 23.58,91.01 23.72,91.14 IC6.8
N$58
  Top 0.254: C23.2 21.76,88.95 23.32,90.51 IC6.9
N$59
  Top 0.254: R15.1 23.22,95.59 IC6.1 24.73,96.83 C15.1
N$60
  Top 0.203: 25.19,80.75 R18.1 25.35,80.59 | 25.35,82.15 25.25,82.25 IC6.22
  pour Top (rank 2, no thermals): 24,82.45 25.9,82.45 25.9,80 23.1,80 23.1,81.25 24,81.25
N$62
  Top 0.203: C21.2 18.75,91 19.53,91.78 IC6.7
N$64
  Top 0.203: C22.2 21.75,79.85 22.45,80.55 22.45,83.35 23.89,84.79 IC6.18
N$65
  Top 0.203: R16.2 17.68,83.1 21.01,83.1 21.39,83.48 21.39,83.95 23.51,86.06 IC6.16
N$66
  Top 0.254: R31.2 22.44,155.24 R29.1 22.59,152.98 R28.1
N$67
  Top 0.254: R34.2 24.1,153.23 R31.1 R33.2 | R33.2 | C73.2 28.9,155.46 28.9,156.5 28.5,156.9 26.2,156.9 25.8,156.5 R33.2
N$68
  Top 0.254: C75.2 28.06,149.7 IC9.6 24.8,149.7 24.5,150 24.5,151.68 25.66,152.84 R34.1
N$69
  Top 0.203: C72.1 30.66,130.66 30.66,130.68 R30.2 C71.2
N$70
  Top 0.203: C72.2 30.73,129.03 30.73,128.9 | 30.73,128.9 R32.1 | IC8.5 30.53,128.08 30.73,128.28 30.73,128.9
N$71
  Top 0.203: R46.4 21.75,121.75 22.35,121.75 24.87,124.27 IC8.2 28.47,124.27 R35.1
N$72
  Top 0.203: C80.1 16.62,128.13 17.05,127.7 R41.1 19.09,128.08 IC8.10
N$73
  Top 0.203: C80.2 R44.2 C81.1
N$74
  Top 0.203: IC8.13 20.98,124.35 R38.2 14.2,124.35 9,119.15 R46.1
N$76
  Top 0.254: IC4.3 64.91,140.06 64.65,139.8 64.65,138.6 65.11,138.14 69.04,138.14 70.27,139.37 IC3.11
N$77  (via drill 0.35)
  Top 0.254: IC4.1 68.27,137.51 v68.3,137.49 | v90.49,140.65 v90.48,140.64 IC3.29
  Bottom 0.254: v68.3,137.49 71.46,140.65 v90.49,140.65
N$78
  Top 0.254: IC4.2 67.64,138.78 69.49,140.64 IC3.10
N$79
  Top 0.254: R8.1 54.05,135.43 C10.1 52.29,136.26 51.37,137.18 46.76,137.18 IC10.3
N$80
  Top 0.254: C10.2 C11.1
N$81
  Top 0.254: R9.2 C12.1 52.32,141.22 50.97,139.87 46.81,139.87 IC10.5
N$82
  Top 0.254: C12.2 C13.1
N$83
  Top 0.254: R11.2 C14.2 R9.1 R10.1
N$84
  Top 0.254: R6.1 C9.2 R8.2 R7.1
NEXT
  Top 0.254: R3.2 68.61,135.01 68.92,135.32 | IC3.12 70.15,138.1 69.55,137.5 69.55,135.95 68.92,135.32 | TP8.TP 69.35,134.9 68.92,135.32
OSC_IOM  (via drill 0.35)
  Top 0.2: IC6.14 24.72,87.32 23.47,87.32 21.25,85.1 20.2,85.1
  Top 0.203: IC7.10 23.58,34.1 8.9,34.1 7,36 7,75.15 6.7,75.45 v6.7,76.06 | 20.2,85.1 16.55,85.1 v15.9,85.75
  Bottom 0.203: v15.9,85.75 6.7,76.55 v6.7,76.06
OSC_IOP  (via drill 0.35)
  Top 0.2: IC6.13 23.57,87.97 21.1,85.5 20.15,85.5
  Top 0.203: IC7.9 23.58,34.8 22.97,34.8 9.25,34.8 7.7,36.35 7.7,75.2 8,75.5 v8,76.06 | 20.15,85.5 17.4,85.5 v17.15,85.75
  Bottom 0.203: v17.15,85.75 8,76.6 v8,76.06
OUT_A  (via drill 0.35)
  Top 0.254: C32.2 31.28,80.6 30.4,80.6 30.3,80.7 30.3,83.7 31.41,84.81 32.3,84.81 IC6.27
  other vias: 33.75,85.05 34.45,84.35 35.1,83.65 35.75,83 47.75,71.15 47.75,70.15 47.75,69.15 47.75,68.15
  pour Top (no thermals): 31.6,85.6 34.1,85.6 36.58,83.12 35.65,82.2 33.25,84.6 31.6,84.6
  pour Bottom: 31.6,85.65 34.35,85.65 37.1,82.9 37.1,80.6 45.4,72.3 51.85,72.3 51.85,67.05 45.45,67.05 31.6,80.9
  pour Top (no thermals): 51.85,72.25 47.25,72.25 47.25,67 51.85,67
OUT_B  (via drill 0.35)
  Top 0.254: C28.2 30.36,78.54 29.7,79.2 29.7,83.67 31.2,85.17 31.2,87.7 31.47,87.97 IC6.32
  other vias: 33.8,88.15 34.8,88.15 35.8,88.15 47.8,84.85 47.8,83.85 47.8,82.8 47.85,81.65
  pour Top (rank 2, no thermals): 31.6,88.15 36.3,88.15 36.3,87.75 31.6,87.75
  pour Top (no thermals): 33.3,87.85 33.3,88.3 33.6,88.6 36.3,88.6 36.3,87.85
  pour Bottom: 31.65,87.6 40.55,87.6 46.1,82.05 48.1,80.05 52,80.05 52,85.35 48.35,85.35 48.1,85.6 44.85,88.85 31.6,88.85 31.6,87.65
  pour Top (no thermals): 51.9,85.4 47.3,85.4 47.3,80.2 51.9,80.2
OUT_C  (via drill 0.35)
  Top 0.254: C29.2 30.32,99.5 29.59,98.77 29.59,94.18 29.6,94.17 29.6,94.1 31.19,92.51 31.19,90.28 31.55,89.91 32.27,89.91 IC6.35
  other vias: 33.8,89.7 34.8,89.7 35.85,89.7 47.7,96.7 47.7,95.7 47.7,94.7 47.7,93.7
  pour Top (no thermals): 31.55,90.05 36.3,90.05 36.3,89.7 31.55,89.7
  pour Top (no thermals): 33.35,90.05 33.35,89.6 33.65,89.3 36.35,89.3 36.35,90.05
  pour Bottom: 31.65,90.45 40.55,90.45 48.1,98 52,98 52,92.7 48.35,92.7 44.85,89.2 31.6,89.2 31.6,90.4
  pour Top (no thermals): 52,97.8 47.15,97.8 47.15,92.5 52,92.5
OUT_D  (via drill 0.35)
  Top 0.254: C27.2 30.17,97.42 30,97.25 30,94.35 31.3,93.05 IC6.40
  other vias: 33.7,92.8 34.4,93.3 35,93.9 35.6,94.5 48,110 48,109 48,108 48,107
  pour Top (no thermals): 31.6,93.25 33.55,93.25 35.55,95.25 36.35,94.45 34.1,92.2 31.6,92.2
  pour Bottom: 31.65,92.2 34.1,92.2 36.7,94.8 36.7,96.85 45.65,105.8 52,105.8 52,111 45.95,111 31.65,96.7
  pour Top (no thermals): 52.1,111 47.45,111 47.45,105.75 52,105.75 52.1,105.85
PLAY
  Top 0.254: R5.2 68.15,143.2 68.25,143.1 71.56,143.1 IC3.8
PREV
  Top 0.254: IC3.16 67.85,133.02 R2.2 67.85,132.96 TP9.TP
PVDD
  Top 0.254: TP3.TP 38,73
  pour Top (no thermals): 31.6,91.9 34.2,91.9 38.7,96.4 39.3,96.4 39.3,94.2 35.5,90.4 31.6,90.4
  pour Top (no thermals): 39.2,94.6 39.2,97 37.35,97 37.35,94.6
  pour Top (no thermals): 31.6,85.9 34.2,85.9 38.7,81.4 39.6,81.4 39.6,83.3 35.4,87.5 31.6,87.5
  pour Top (no thermals): 40.4,82.8 40.4,80.25 37.35,80.25 37.35,82.8
  pour Top (no thermals): 37.4,67.4 37.4,97 41,97 41,67.4
  pour Top (no thermals): 37.35,95.4 37.35,105 41,105 41,95.4
PVDD2
  Top 0.254: IC2.1 33.63,56.35 34.3,55.68 TP2.TP
  pour Top (no thermals): 37.4,24.5 37.4,58.55 41,58.55 41,24.5
  pour Top (no thermals): 30.5,36.2 32.15,36.2 37.25,41.3 39,41.3 39,39.75 33.85,34.6 30.5,34.6
  pour Top (no thermals): 30.5,30.15 32.15,30.15 37.25,25.05 39,25.05 39,26.65 33.9,31.75 30.5,31.75
  pour Top (no thermals): 30.7,57.45 38.4,57.45 38.4,55.25 30.7,55.25
RESET  (via drill 0.35)
  Top 0.203: IC6.5 20.15,93.05 18.6,94.6 16.75,94.6 16.41,94.94 16.41,95.8 R12.1 | IC7.18 22.6,29.05 21.6,30.05 17.45,30.05 16.15,28.75 13.3,28.75 4.8,37.25 4.8,74.8 5.4,75.4 v5.4,76.06
  Top 0.254: IC3.37 84.9,150.8 83.5,149.4 83.5,124.45 81.6,122.55 32.4,122.55 15.85,106 15.85,99.95 15.25,99.35 v15.25,98.8 15.25,95.9 15.35,95.8 16.41,95.8
  Bottom 0.203: v5.4,76.06 5.4,75 4.45,74.05 1.75,74.05 1.15,74.65 1.15,76.3 15.25,90.4 v15.25,98.8
RIGHT  (via drill 0.35)
  Top 0.203: v18.65,135.45 18.67,135.43 C81.2 | v19.05,149.65 19.1,149.7 IC9.9
  Top 0.254: IC9.9 IC9.8 20.67,153.06 R29.2 | TP7.TP 20.7,134.1 C81.2
  Bottom 0.203: v19.05,149.65 18.65,149.25 v18.65,135.45
RIGHT_VOLUME
  Top 0.203: IC8.9 21.03,129.38 R44.1 18.67,130.08 18.5,130.25 15.9,130.25 15.5,129.85 15.5,127.85 16.65,126.7 R38.1
  Top 0.254: IC8.8 IC8.9
RXD0
  Top 0.254: IC3.34 90.41,146.99 91.64,145.75 J1.3
SIG_IN_LEFT
  Top 0.254: C25.2 13.95,144 10.95,147 J2.5 7.1,147 6.05,148.05 6.05,158.1 6.85,158.9 43.15,158.9 46.7,155.35 SJ2.2
SIG_IN_RIGHT
  Top 0.254: C78.2 13.4,150.6 12.75,151.25 12.75,155.65 11.4,157 11.35,157 | 11.35,157 J2.2 | SJ1.2 44.2,153.75 39.95,158 12.35,158 11.35,157
SPEAKER_B_0
  Top 0.203: C67.1 78,55.88 78,53 | C69.1 80,55.97 80,53
  pour Top (no thermals): 61.55,52.25 63.85,49.95 83.45,49.95 86,47.4 86,38 90,38 90,49 85,54 66,54 62.2,57.8 58.55,57.8 58.55,52.25
  pour Top (no thermals): 86,38.45 79,31.45 79,22 83,22 83,30 88,35 90,35 90,39 86,39
  pour Top (no thermals): 58.55,28.9 58.55,21 arc90 59.55,20 82,20 arc90 83,21 83,28 arc90 82,29 80,29 arc90 79,28 79,25 arc-90 78,24 64,24 arc-90 63,25 63,27.9 arc90 62,28.9
SPEAKER_B_1
  Top 0.203: C68.2 79.85,13.85 80,14 | C70.2 81.93,13.93 82,14
  pour Bottom (no thermals): 90,29.95 83,36.95 83,41 79,41 79,35 87,27 90,27
  pour Top (no thermals): 61.55,14.75 63.85,17.05 83.45,17.05 86,19.6 86,30 87,31 90,31 90,18 85,13 66,13 62.2,9.2 58.55,9.2 58.55,14.75
  pour Top (no thermals): 58.55,38.1 58.55,46 arc-90 59.55,47 82,47 arc-90 83,46 83,39 arc-90 82,38 80,38 arc-90 79,39 79,42 arc90 78,43 64,43 arc90 63,42 63,39.1 arc-90 62,38.1
SPEAKER_L_0
  Top 0.152: 77,103.76 C41.1
  Top 0.254: C37.1 74.95,103.75 74.95,105.9 75.05,106 77,106 77,103.76
  pour Top (no thermals): 58.75,104.55 90.05,104.55 90.05,107.5 66.4,107.5 66.4,111.1 58.75,111.1
SPEAKER_L_1
  Top 0.254: C38.2 69,100.01 69,97 71,97 71,100.07 C42.2
  pour Top (no thermals): 58.65,99.2 90.05,99.2 90.05,95 66.4,95 66.4,92.4 58.65,92.4
SPEAKER_R_0
  Top 0.254: C39.1 68.8,77.98 68.8,80 70.85,80 70.85,78 C43.1
  pour Top (no thermals): 58.65,78.95 90.1,78.95 90.1,81.9 66.45,81.9 66.45,85.5 58.65,85.5
SPEAKER_R_1
  Top 0.254: C44.2 77,72 75,72 74.92,72.08 C40.2
  pour Top (no thermals): 58.6,73.7 90,73.7 90,69.5 66.35,69.5 66.35,66.9 58.6,66.9
STOP
  Top 0.254: R4.2 66.08,143.02 66.35,142.75 67.35,142.75 68.25,141.85 71.58,141.85 IC3.9
TGHJESYRJK
  Top 0.254: C14.1 52.21,140.06 51.3,139.15 47.6,139.15 47.59,139.14 45.51,139.14 45.25,139.4 45.25,140.7 45.59,141.04 IC10.6 IC10.7 46.71,145.08 SJ2.1
TXD0  (via drill 0.35)
  Top 0.254: J1.2 v92.36,144.5 v92.35,144.5 | v90.6,148.2 88.7,148.2 IC3.35
  Bottom 0.254: v92.35,144.5 92.35,146.45 v90.6,148.2
VDD  (via drill 0.35)
  Top 0.203: IC5.4 4.2,91 3.75,91.45 v3.75,91.95 | v7.1,97.9 C24.1 R47.2 | C77.1 48.46,138.45 46.76,138.45 IC10.4 | IC8.4 28.05,126.81 C74.1 | R42.2 15.03,146.2 R39.2
  Top 0.254: D1.1 93.22,136.23 v93.25,136.2 | v56.3,146.6 IC1.3 | IC8.4 25.09,126.81 v25.05,126.85 | R42.2 14.04,149.25 v13.85,149.25 | v24.76,147.2 26.05,147.2 IC9.4 27.06,147.16 27.35,147.45 27.35,148.25 27.55,148.45 29.85,148.45 30.05,148.25 30.05,147.6 | 30.05,147.6 R36.2 | IC10.4 45.32,138.5 v45.3,138.48 | v31.15,147.6 30.05,147.6 | TP5.TP 37.4,110.83 v37.42,110.8 | v52.1,148.3 51,148.3 49.8,149.5 JP1.1
  Top 0.305: v22.9,98.6 22.98,98.52 R15.2 | IC6.21 26.61,82.89 27.15,82.35 R18.2
  Top 0.508: C4.1 v52.1,148.3
  Bottom 0.203: v3.75,91.95 3.75,96.25 5.4,97.9 v7.1,97.9
  Bottom 0.254: v93.25,136.2 93.25,139.82 86.47,146.6 v56.3,146.6 | v25.05,126.85 35.45,126.85 36.15,126.15 | v7.1,97.9 9.55,100.35 21.15,100.35 v22.9,98.6 | v13.85,149.25 15.4,150.8 21.16,150.8 v24.76,147.2 | v45.3,138.48 36.18,147.6 v31.15,147.6
  Bottom 0.305: v27.1,77.35 27.1,94.4 v22.9,98.6
  Bottom 0.508: v52.1,148.3 52.1,145.28 v45.3,138.48 37.9,131.08 37.9,126.75
  other vias: 36.45,110.8 38.4,110.8
  pour Top (no thermals): 52.85,148.95 57.15,148.95 57.15,147.7 52.85,147.7
  pour Top (no thermals): 22.35,97.1 22.35,102.85 23.65,104.15 24.15,104.15 24.15,102.75 24.1,102.75 23.5,102.15 23.5,97.1
  pour Top (no thermals): 39.95,108.35 39.95,109.8 38.3,111.45 28.45,111.45 22.35,105.35 22.35,101.9 24.35,101.9 24.35,105.5 29,110.15 37.35,110.15 37.95,109.55 37.95,108.35
  pour Top (no thermals): 26.65,76.9 26.65,80.95 27.65,80.95 27.65,76.9
  pour Bottom: 35,128 35,110 40,110 40,128
VDD2  (via drill 0.35)
  Top 0.254: IC7.2 21.69,39.21 R23.1
  Top 0.305: C47.1 17.9,42.13 17.9,39.4 18.57,38.73 C52.1 | C52.1 R23.1 | C52.1 17.98,38.73 v17.75,38.5 | v18.75,26.1 19.72,26.1 R24.1
  Bottom 0.305: v17.75,38.5 17.75,27.1 v18.75,26.1
  pour Top (no thermals): 27.45,55.15 25.95,55.15 17,46.2 17,43 15.25,43 15.25,46.8 25.95,57.5 27.45,57.5
  pour Top (no thermals): 27.5,55.05 27.5,59.4 25.75,59.4 25.7,59.35 25.7,55.05

## Text on the board
tPlace: 30V | GND | GND | 36V | TSTE93: Ruski Hardbass / 10/03-2021 / V:1.0 / By: JS, JO & VE.